# EAGLE design Esquematico (EAGLE 9.6.2)
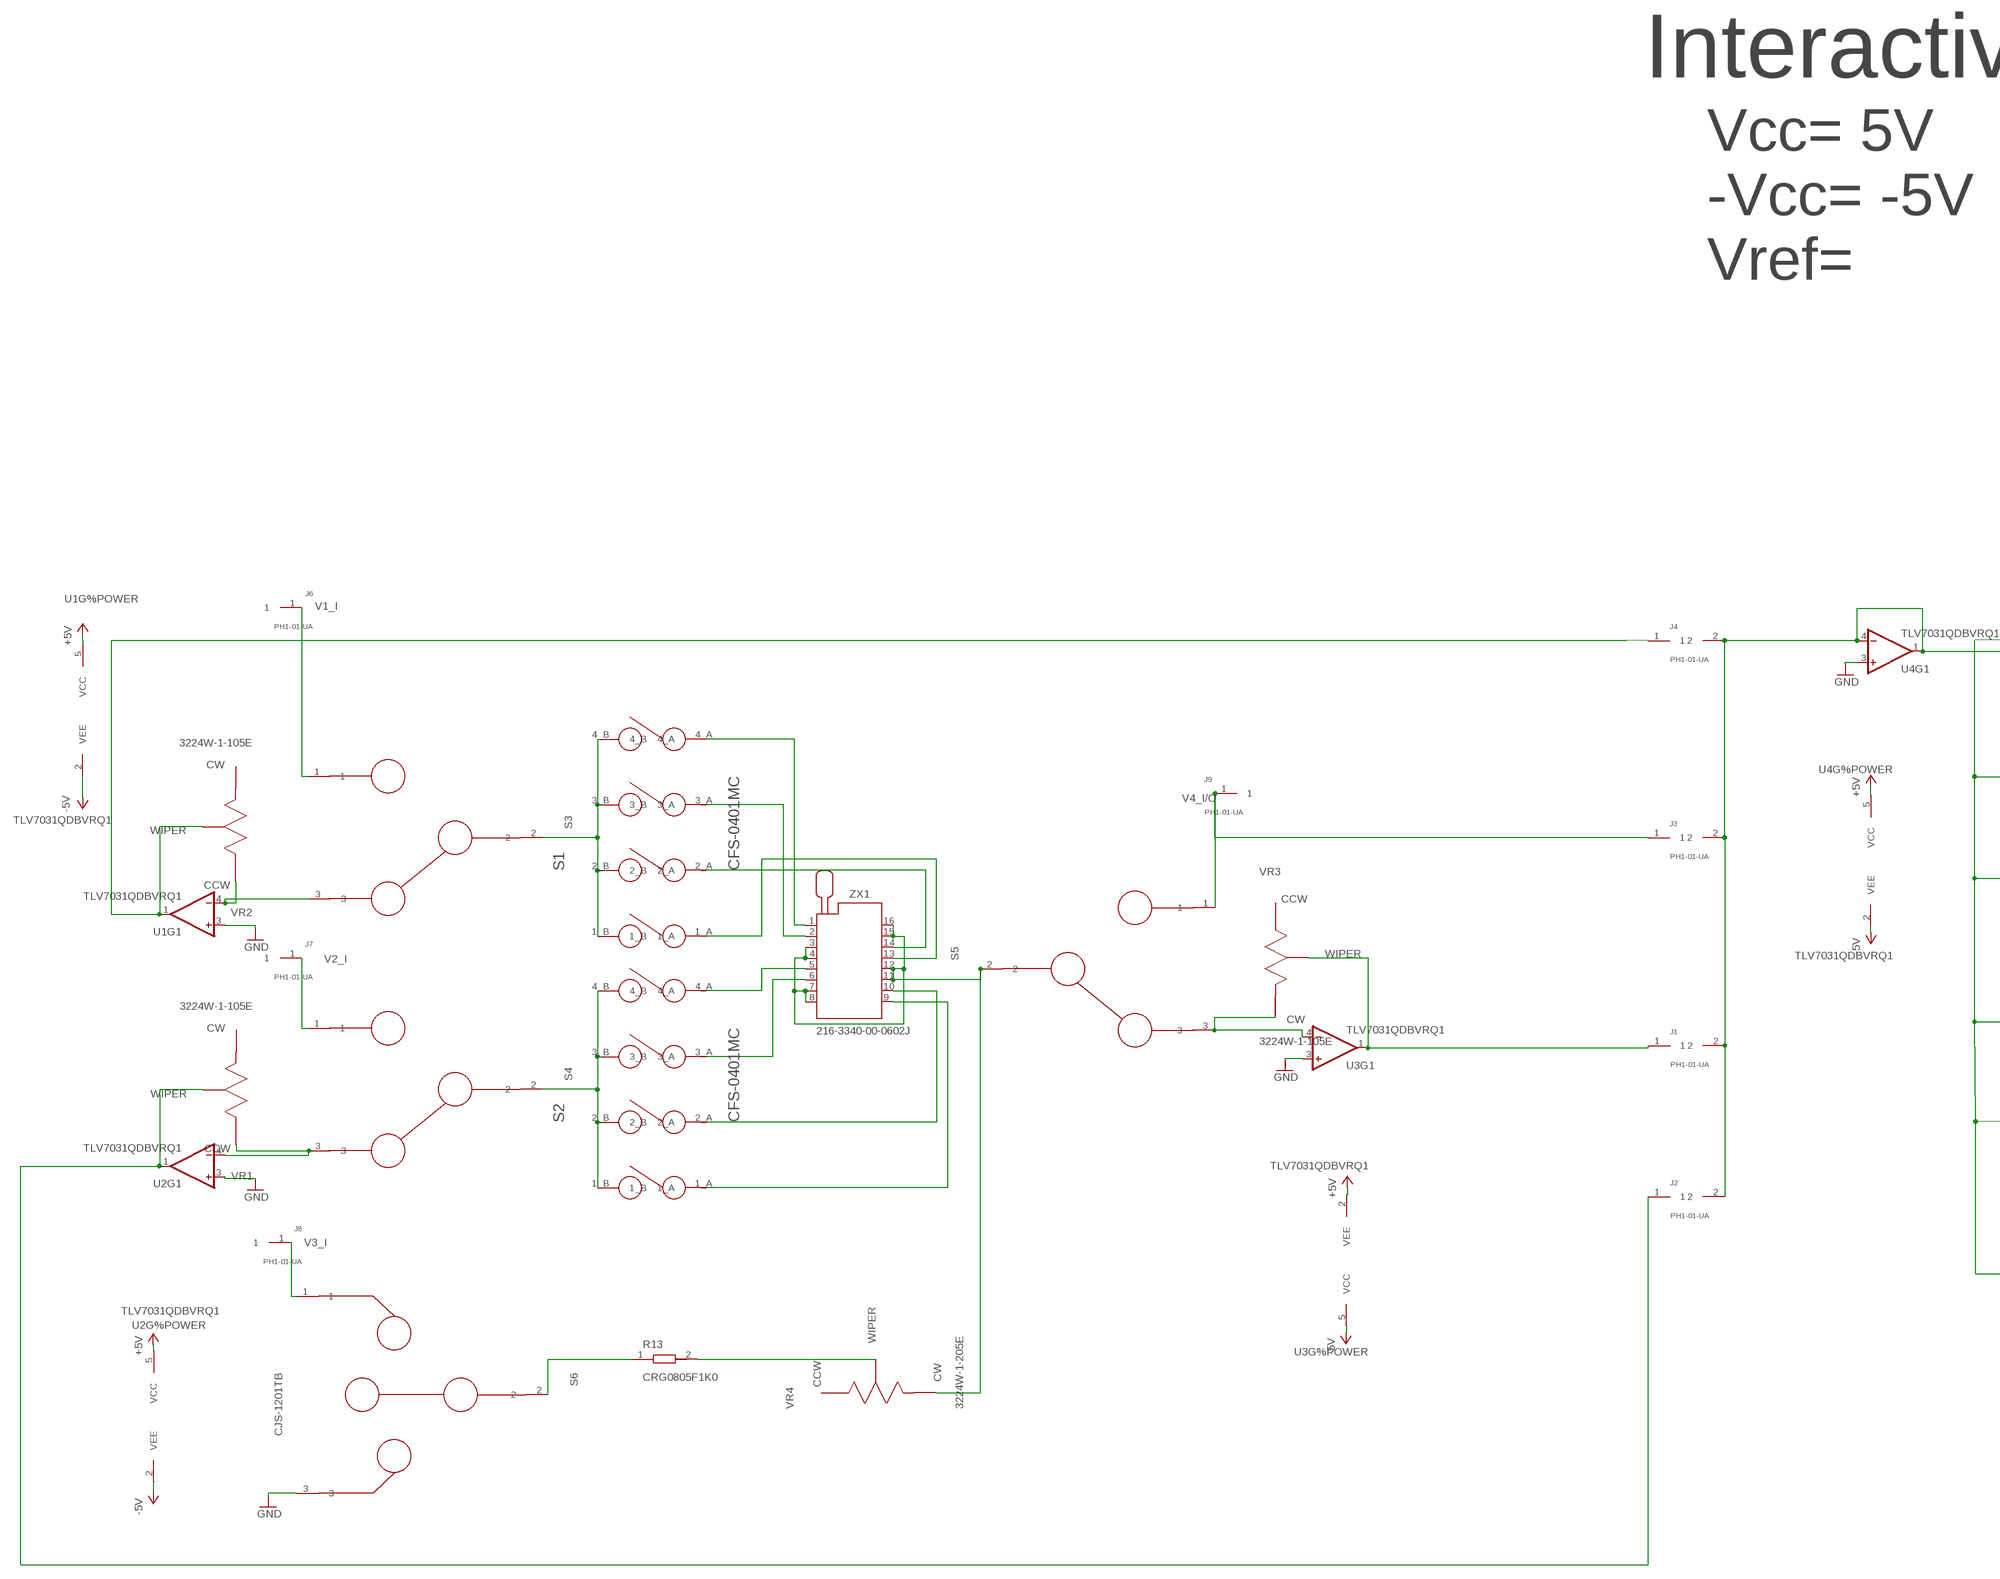
[diagram p0: schematic, sheet 1, part 1 of 2]
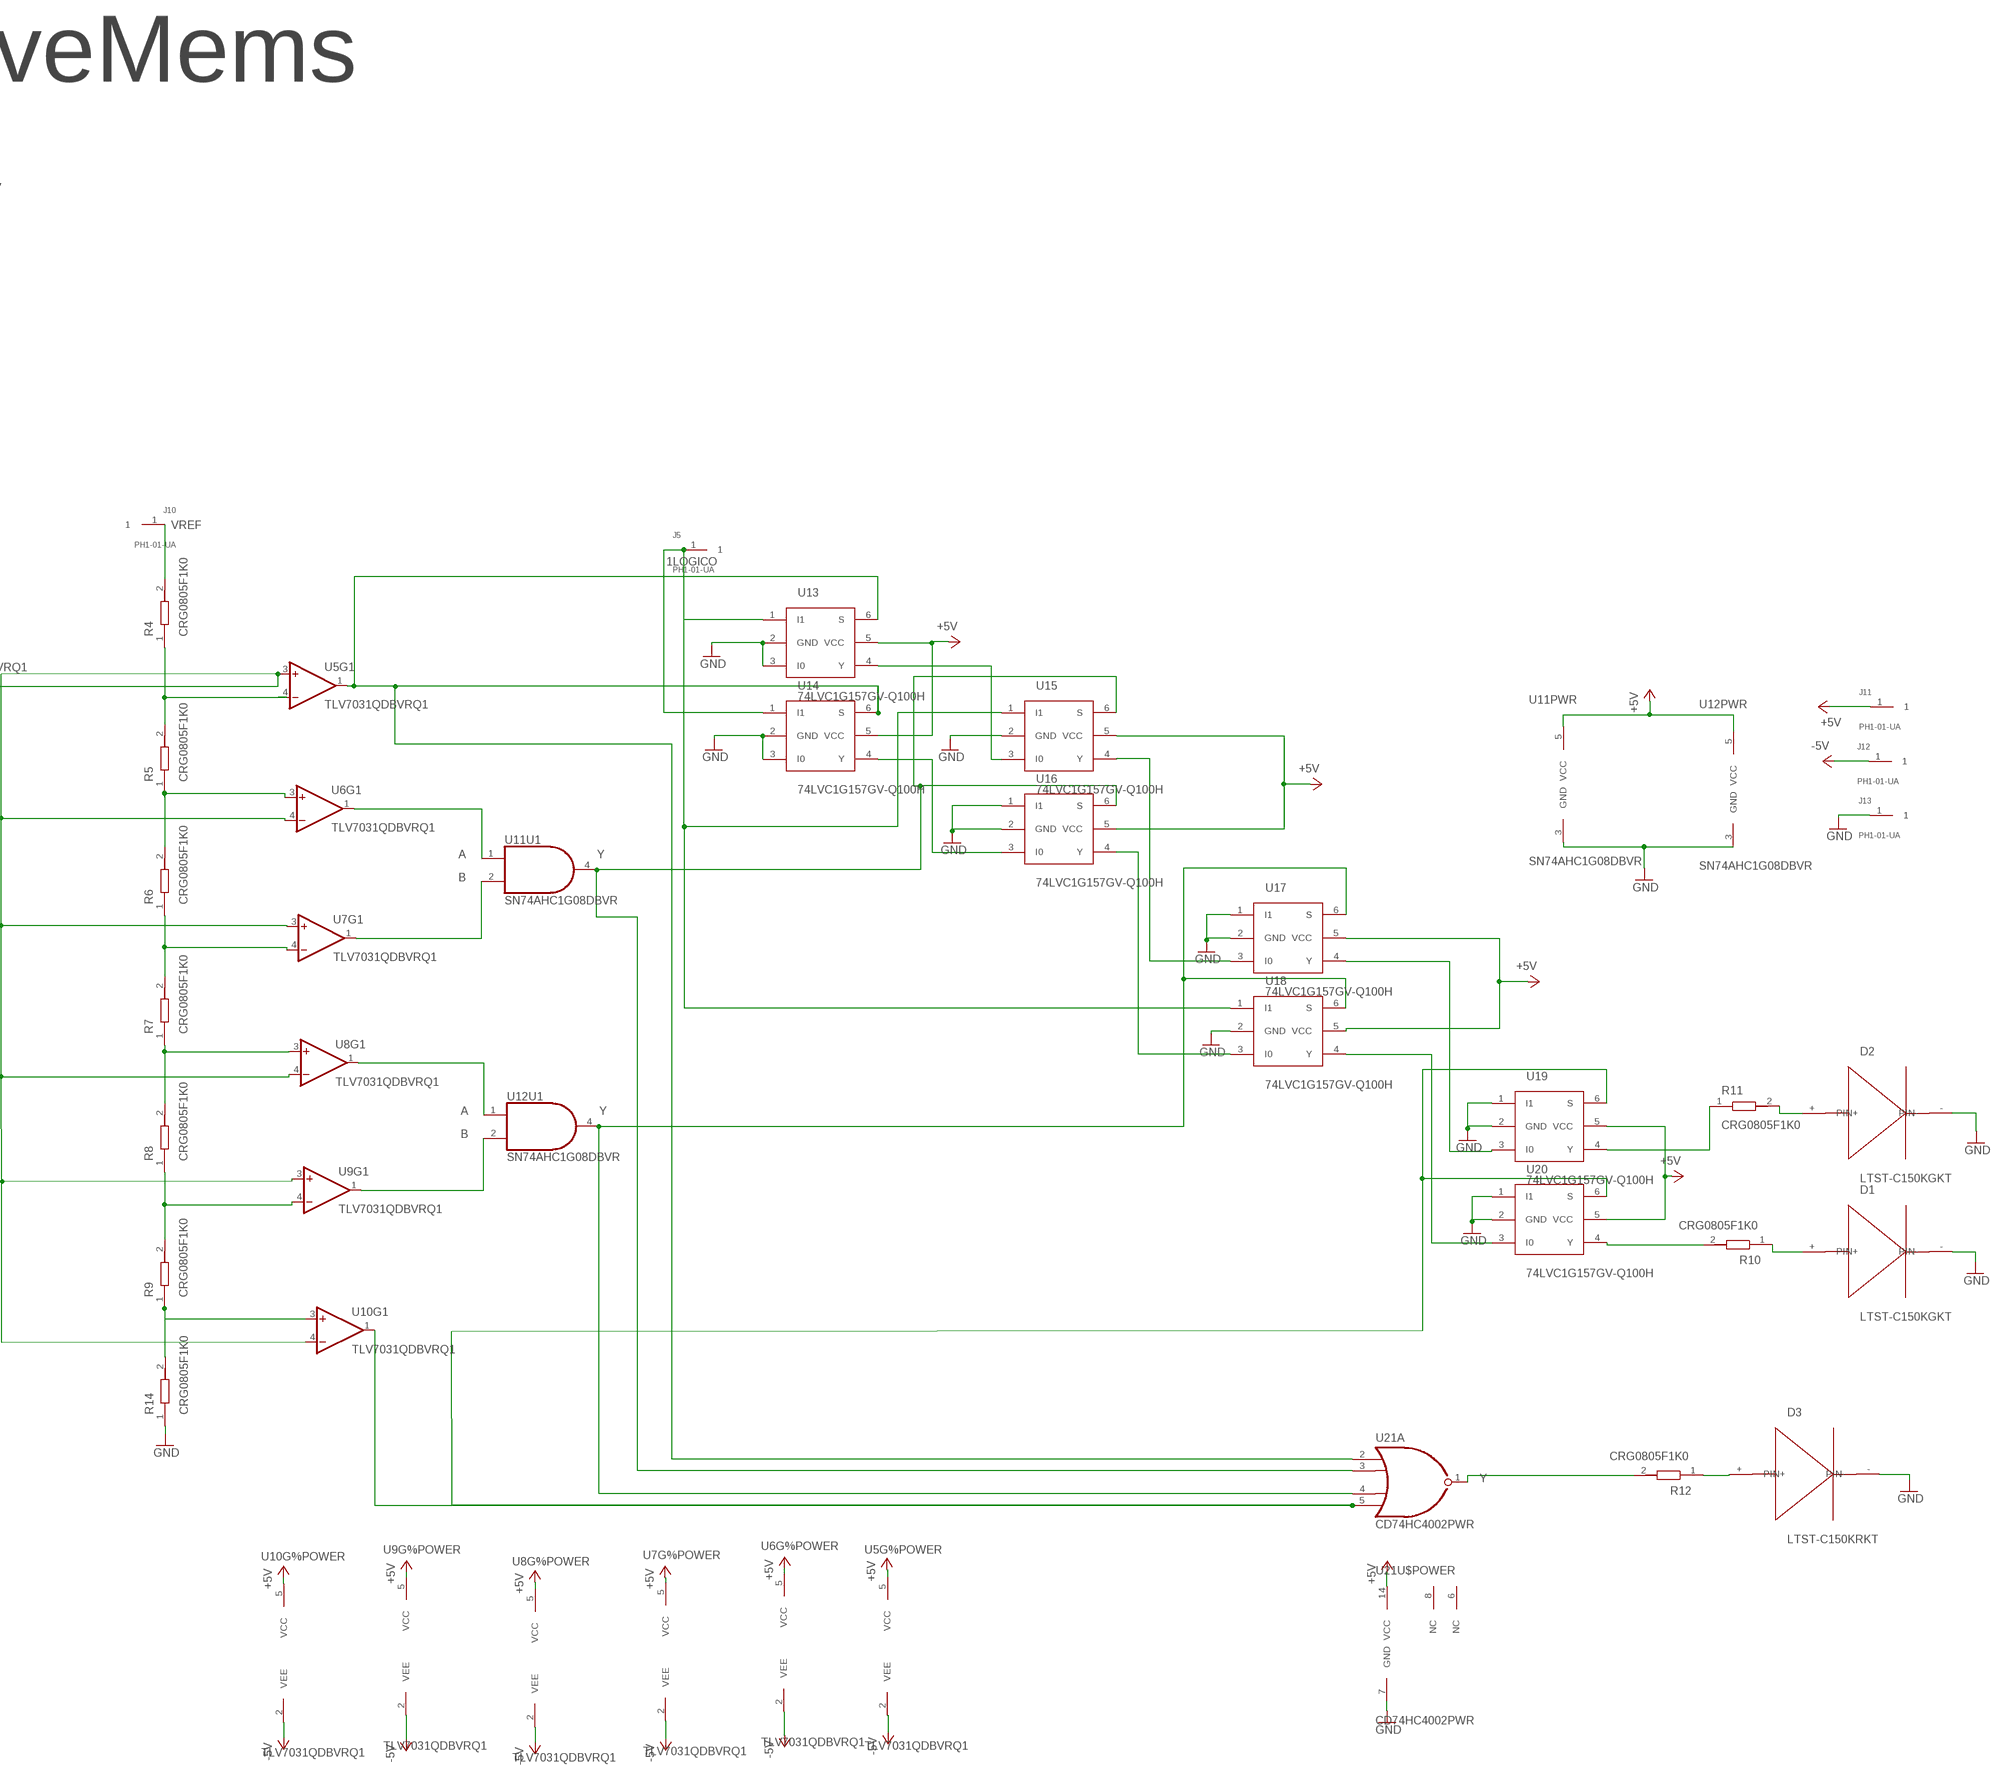
[diagram p1: schematic, sheet 1, part 2 of 2]

## Parts
D1  LTST-C150KGKT  LTST-C150KRKT  [1206]
D2  LTST-C150KGKT  LTST-C150KRKT  [1206]
D3  LTST-C150KRKT  [1206]
J1  PH1-01-UA  (2X)PH1-01-UA  [HEADER]
J2  PH1-01-UA  (2X)PH1-01-UA  [HEADER]
J3  PH1-01-UA  (2X)PH1-01-UA  [HEADER]
J4  PH1-01-UA  (2X)PH1-01-UA  [HEADER]
J5  PH1-01-UA  [HEADER]
J6  PH1-01-UA  [HEADER]
J7  PH1-01-UA  [HEADER]
J8  PH1-01-UA  [HEADER]
J9  PH1-01-UA  [HEADER]
J10  PH1-01-UA  [HEADER]
J11  PH1-01-UA  PH1-01-UA  [HEADER]
J12  PH1-01-UA  PH1-01-UA  [HEADER]
J13  PH1-01-UA  PH1-01-UA  [HEADER]
R4  CRG0805F1K0  CRG0805F1K0  [0805]
R5  CRG0805F1K0  CRG0805F1K0  [0805]
R6  CRG0805F1K0  CRG0805F1K0  [0805]
R7  CRG0805F1K0  CRG0805F1K0  [0805]
R8  CRG0805F1K0  CRG0805F1K0  [0805]
R9  CRG0805F1K0  CRG0805F1K0  [0805]
R10  CRG0805F1K0  CRG0805F1K0  [0805]
R11  CRG0805F1K0  CRG0805F1K0  [0805]
R12  CRG0805F1K0  CRG0805F1K0  [0805]
R13  CRG0805F1K0  [0805]
R14  CRG0805F1K0  CRG0805F1K0  [0805]
S1  CFS-0401MC  [DIP_SPST-4]
S2  CFS-0401MC  [DIP_SPST-4]
S3  CJS-1200TB  CJS-1200B  [SPDT]
S4  CJS-1200TB  CJS-1200B  [SPDT]
S5  CJS-1200TB  CJS-1200B  [SPDT]
S6  CJS-1201TB  [SPDT_ON-OFF-ON]
U1  TLV7031QDBVRQ1  [SOT-23]
U2  TLV7031QDBVRQ1  [SOT-23]
U3  TLV7031QDBVRQ1  [SOT-23]
U4  TLV7031QDBVRQ1  [SOT-23]
U5  TLV7031QDBVRQ1  [SOT-23]
U6  TLV7031QDBVRQ1  [SOT-23]
U7  TLV7031QDBVRQ1  [SOT-23]
U8  TLV7031QDBVRQ1  [SOT-23]
U9  TLV7031QDBVRQ1  [SOT-23]
U10  TLV7031QDBVRQ1  [SOT-23]
U11  SN74AHC1G08DBVR  [SOT-23-5]
U12  SN74AHC1G08DBVR  [SOT-23-5]
U13  74LVC1G157GV-Q100H  [6-TSOP]
U14  74LVC1G157GV-Q100H  [6-TSOP]
U15  74LVC1G157GV-Q100H  [6-TSOP]
U16  74LVC1G157GV-Q100H  [6-TSOP]
U17  74LVC1G157GV-Q100H  [6-TSOP]
U18  74LVC1G157GV-Q100H  [6-TSOP]
U19  74LVC1G157GV-Q100H  [6-TSOP]
U20  74LVC1G157GV-Q100H  [6-TSOP]
U21  CD74HC4002PWR  [14-TSSOP]
VR1  3224W-1-105E  3224W-1-205E  [3224W-1-205E]
VR2  3224W-1-105E  3224W-1-205E  [3224W-1-205E]
VR3  3224W-1-105E  3224W-1-205E  [3224W-1-205E]
VR4  3224W-1-205E  [3224W-1-205E]
ZX1  216-3340-00-0602J  [216-3340-00-0602J]

## Nets
1LOGICO: J5.1 U13.1(I1) U14.1(I1) U15.1(I1) U18.1(I1)
+5V: J11.1 U1.5(G%POWER:VCC) U2.5(G%POWER:VCC) U3.2(G%POWER:VEE) U4.5(G%POWER:VCC) U5.5(G%POWER:VCC) U6.5(G%POWER:VCC) U7.5(G%POWER:VCC) U8.5(G%POWER:VCC) U9.5(G%POWER:VCC) U10.5(G%POWER:VCC) U11.5(PWR:VCC) U12.5(PWR:VCC) U13.5(VCC) U14.5(VCC) U15.5(VCC) U16.5(VCC) U17.5(VCC) U18.5(VCC) U19.5(VCC) U20.5(VCC) U21.14(U$POWER:VCC)
-5V: J12.1 U1.2(G%POWER:VEE) U2.2(G%POWER:VEE) U3.5(G%POWER:VCC) U4.2(G%POWER:VEE) U5.2(G%POWER:VEE) U6.2(G%POWER:VEE) U7.2(G%POWER:VEE) U8.2(G%POWER:VEE) U9.2(G%POWER:VEE) U10.2(G%POWER:VEE)
GND: D1.-(PIN-) D2.-(PIN-) D3.-(PIN-) J13.1 R14.1 S6.3 U1.3(+IN) U2.3(+IN) U3.3(+IN) U4.3(+IN) U11.3(PWR:GND) U12.3(PWR:GND) U13.2(GND) U13.3(I0) U14.2(GND) U14.3(I0) U15.2(GND) U16.1(I1) U16.2(GND) U17.1(I1) U17.2(GND) U18.2(GND) U19.1(I1) U19.2(GND) U20.1(I1) U20.2(GND) U21.7(U$POWER:GND)
N$1: S5.2 VR4.3(CW) ZX1.3 ZX1.4 ZX1.7 ZX1.8 ZX1.11 ZX1.12 ZX1.15 ZX1.16
N$2: S1.4_A ZX1.1
N$3: S1.3_A ZX1.2
N$4: S1.2_A ZX1.14
N$5: S1.1_A ZX1.13
N$6: R6.1 R7.2 U7.4(-IN)
N$7: U9.1(OUT) U12.2(U1:B)
N$8: S2.2_A ZX1.10
N$9: S2.1_A ZX1.9
N$10: S1.1_B S1.2_B S1.3_B S1.4_B S3.2
N$11: S2.1_B S2.2_B S2.3_B S2.4_B S4.2
N$12: S3.3 U1.4(-IN) VR2.1(CCW)
N$13: S4.3 U2.4(-IN) VR1.1(CCW)
N$14: S5.3 U3.4(-IN) VR3.3(CW)
N$15: D2.+(PIN+) R11.2
N$16: D1.+(PIN+) R10.1
N$17: D3.+(PIN+) R12.1
N$18: J1.2 J2.2 J3.2 J4.2 U4.1(OUT) U4.4(-IN) U5.3(+IN) U6.4(-IN) U7.3(+IN) U8.4(-IN) U9.3(+IN) U10.4(-IN)
N$21: R13.1 S6.2
N$23: U8.1(OUT) U12.1(U1:A)
N$26: U7.1(OUT) U11.2(U1:B)
N$27: U6.1(OUT) U11.1(U1:A)
N$28: R13.2 VR4.2(WIPER)
N$29: S2.4_A ZX1.5
N$30: R4.1 R5.2 U5.4(-IN)
N$31: S2.3_A ZX1.6
N$32: R5.1 R6.2 U6.3(+IN)
N$33: R9.1 R14.2 U10.3(+IN)
N$34: R7.1 R8.2 U8.3(+IN)
N$35: R8.1 R9.2 U9.4(-IN)
N$36: U5.1(OUT) U13.6(S) U14.6(S) U21.2(A:A)
N$37: U11.4(U1:Y) U15.6(S) U16.6(S) U21.3(A:B)
N$38: U15.4(Y) U17.3(I0)
N$39: U14.4(Y) U16.3(I0)
N$40: U13.4(Y) U15.3(I0)
N$41: U16.4(Y) U18.3(I0)
N$42: U12.4(U1:Y) U17.6(S) U18.6(S) U21.4(A:C)
N$43: U17.4(Y) U19.3(I0)
N$44: U18.4(Y) U20.3(I0)
N$45: R10.2 U20.4(Y)
N$47: R11.1 U19.4(Y)
N$49: U10.1(OUT) U19.6(S) U20.6(S) U21.5(A:D)
N$50: R12.2 U21.1(A:Y)
V1_I: J6.1 S3.1
V1_O: J4.1 U1.1(OUT) VR2.2(WIPER)
V2_I: J7.1 S4.1
V2_O: J2.1 U2.1(OUT) VR1.2(WIPER)
V3_I: J8.1 S6.1
V3_O: J1.1 U3.1(OUT) VR3.2(WIPER)
V4_I/O: J3.1 J9.1 S5.1
VREF: J10.1 R4.2
Unconnected: U21.6(U$POWER:NC) U21.8(U$POWER:NC) U21.9(B:A) U21.10(B:B) U21.11(B:C) U21.12(B:D) U21.13(B:Y) VR1.3(CW) VR2.3(CW) VR3.1(CCW) VR4.1(CCW)

## Notes on the sheet
- InteractiveMems
- Vcc= 5V
  -Vcc= -5V
  Vref=

## Library data of the parts
D1 D2 = LTST-C150KRKT - Lite-On:LTST-C150KRKT; PARTNO: LTST-C150KGKT
D3 = LTST-C150KRKT - Lite-On:LTST-C150KRKT; PARTNO: LTST-C150KRKT
J1-J4 = (2x)PH1-01-UA - Adam Tech:(2X)PH1-01-UA; PARTNO: PH1-01-UA
J5-J13 = PH1-01-UA - Adam Tech:PH1-01-UA; PARTNO: PH1-01-UA
R4-R14 = CRG0805F1K0 - TE:CRG0805F1K0; PARTNO: CRG0805F1K0
S1 S2 = CFS-0401MC - Nidec Copal Electronics:CFS-0401MC; PARTNO: CFS-0401MC
S3-S5 = CJS-1200TB - Nidec Copal:CJS-1200B; PARTNO: CJS-1200TB
S6 = CJS-1201TB - Nidec Copal Electronics:CJS-1201TB; PARTNO: CJS-1201TB
U1-U10 = TLV7031QDBVRQ1 - Texas Instruments:TLV7031QDBVRQ1; PARTNO: TLV7031QDBVRQ1
U11 U12 = SN74AHC1G08DBVR - TI:SN74AHC1G08DBVR; PARTNO: SN74AHC1G08DBVR
U13-U20 = 74LVC1G157GV-Q100H - Nexperia:74LVC1G157GV-Q100H; PARTNO: 74LVC1G157GV-Q100H
U21 = CD74HC4002PWR:CD74HC4002PWR; PARTNO: CD74HC4002PWR
VR1-VR3 = 3224W-1-205E - Bourns:3224W-1-205E; PARTNO: 3224W-1-105E
VR4 = 3224W-1-205E - Bourns:3224W-1-205E; PARTNO: 3224W-1-205E
ZX1 = 216-3340-00-0602J:216-3340-00-0602J: Zero Insertion Force Socked Source: http://www.3M.com/ehpd Check availability <https://pricing.snapeda.com/parts/216-3340-00-0602J/3M%20Electronic%20Solutions%20Division/view-part?ref=eda>; PARTNO: 216-3340-00-0602J

## Board
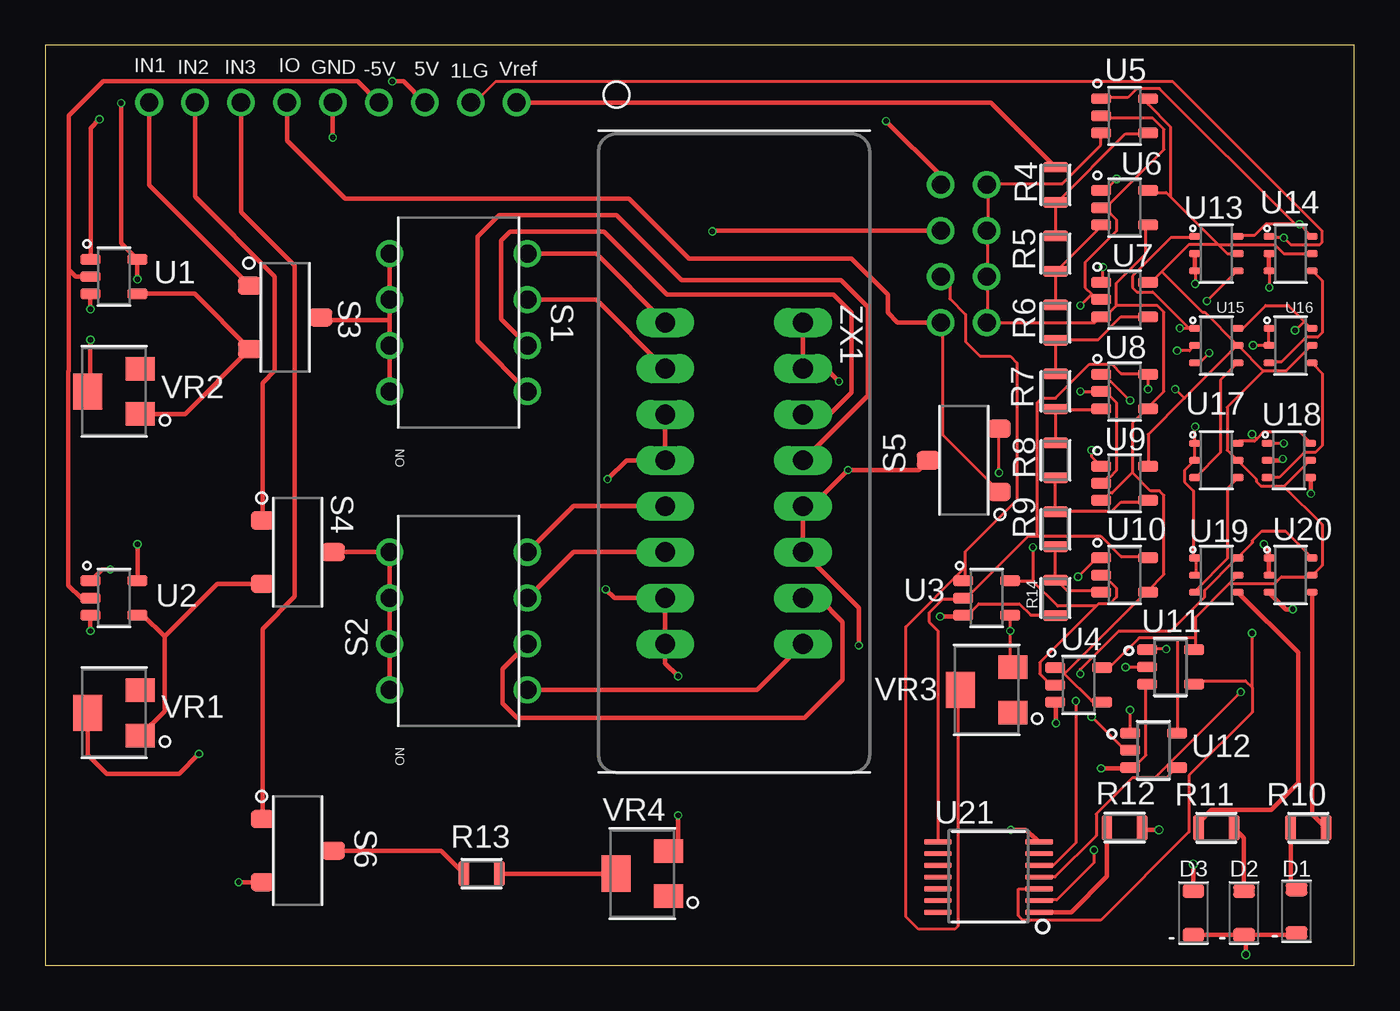
[diagram p2: board, top side]
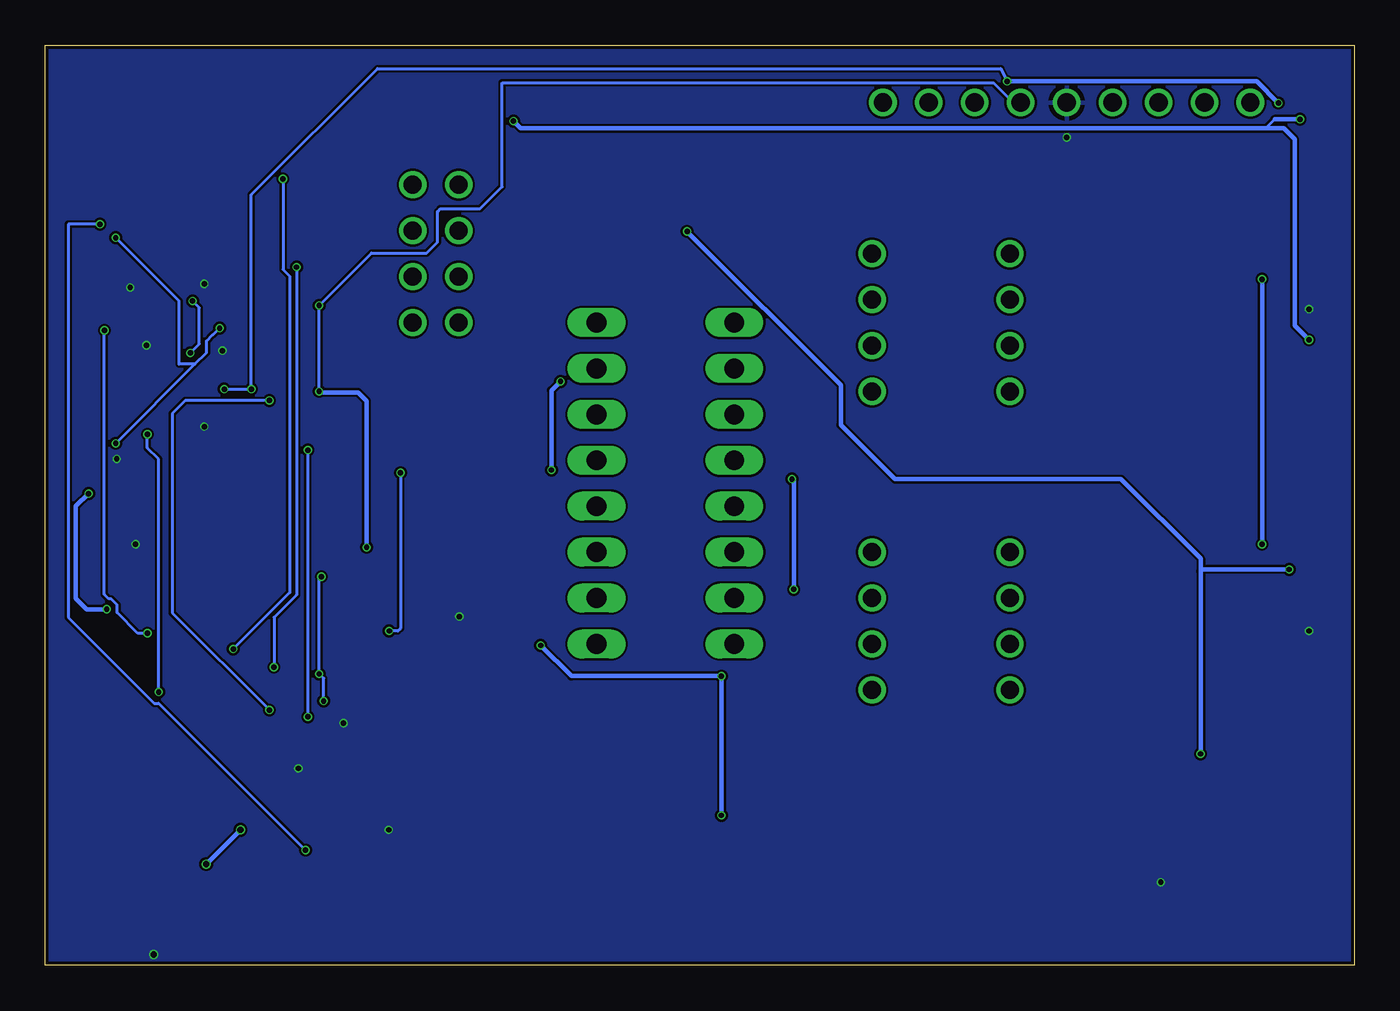
[diagram p3: board, bottom side, seen from below]

Size 72.4 x 50.9 mm. Coordinates in mm from the lower left corner, seen from the top.
Outline: 0,0 72.4,0 72.4,50.9 0,50.9 0,0
Copper layers (1*16): Top 0.035mm / dielectric 1.6mm / Bottom 0.035mm
Design rules "jlcpcb-2layers *": minimum track width 5mil, minimum drill 0.3mm, track to track 5mil, track to pad 5mil, pad to pad 5mil, via to via 5mil, smd to smd 5mil, copper to edge 0.2mm, drill to drill 6mil, minimum pad ring 10mil, minimum via ring 3mil, stop-mask expansion 4mil, vias tented up to drill 15mil, thermal gap 10mil

### Footprints (pad centres in the part's own frame; a part is rotated, then mirrored left to right if it is on the bottom)
1206 = smd 1.2 x 0.77: + 0,1.215; - 0,-1.215
HEADER = drill 1: 1 -1.27,0; 2 1.27,0
HEADER' = drill 1.016: 1 0,0
0805 = smd 0.6 x 1.4: 1 -0.975,0; 2 0.975,0
DIP_SPST-4 = drill 1: 1_A -3.81,-3.81; 1_B -3.81,3.81; 2_A -1.27,-3.81; 2_B -1.27,3.81; 3_A 1.27,-3.81; 3_B 1.27,3.81; 4_A 3.81,-3.81; 4_B 3.81,3.81
SPDT = smd 1 x 1.3: 1 -1.75,-1.95; 2 0,1.95; 3 1.75,-1.95
SPDT_ON-OFF-ON = smd 1 x 1.3: 1 -1.75,-1.95; 2 0,1.95; 3 1.75,-1.95
SOT-23 = smd 1.1 x 0.6: 1 -1.3,0.95; 2 -1.3,0; 3 -1.3,-0.95; 4 1.3,-0.95; 5 1.3,0.95
SOT-23-5 = smd 1.1 x 0.6: 1 -1.3,0.95; 2 -1.3,0; 3 -1.3,-0.95; 4 1.3,-0.95; 5 1.3,0.95
6-TSOP = smd 0.6 x 0.4: 1 -1.2,0.95; 2 -1.2,0; 3 -1.2,-0.95; 4 1.2,-0.95; 5 1.2,0; 6 1.2,0.95
14-TSSOP = smd 1.55 x 0.3: 1 -2.8,1.95; 2 -2.8,1.3; 3 -2.8,0.65; 4 -2.8,0; 5 -2.8,-0.65; 6 -2.8,-1.3; 7 -2.8,-1.95; 8 2.8,1.95; 9 2.8,1.3; 10 2.8,0.65; 11 2.8,0; 12 2.8,-0.65; 13 2.8,-1.3; 14 2.8,-1.95
3224W-1-205E = smd 1.6 x 1.3: 1 1.45,-1.25; 3 1.45,1.25 | smd 1.6 x 2: 2 -1.45,0
216-3340-00-0602J = drill 1.1 long: 1 -8.89,-3.81; 2 -6.35,-3.81; 3 -3.81,-3.81; 4 -1.27,-3.81; 5 1.27,-3.81; 6 3.81,-3.81; 7 6.35,-3.81; 8 8.89,-3.81; 9 8.89,3.81; 10 6.35,3.81; 11 3.81,3.81; 12 1.27,3.81; 13 -1.27,3.81; 14 -3.81,3.81; 15 -6.35,3.81; 16 -8.89,3.81

### Placement (x,y rotation side)
D1  69.2,3 0 top
D2  66.3,2.9 0 top
D3  63.5,2.9 0 top
J1  50.8,38.1 0 top
J2  50.8,40.64 0 top
J3  50.8,35.56 0 top
J4  50.8,43.18 0 top
J5  PH1-01-UA  [HEADER']  23.53,47.73 0 top
J6  PH1-01-UA  [HEADER']  5.75,47.73 180 top
J7  PH1-01-UA  [HEADER']  8.29,47.73 0 top
J8  PH1-01-UA  [HEADER']  10.83,47.73 0 top
J9  PH1-01-UA  [HEADER']  13.37,47.73 0 top
J10  PH1-01-UA  [HEADER']  26.07,47.73 0 top
J11  PH1-01-UA  [HEADER']  20.99,47.73 0 top
J12  PH1-01-UA  [HEADER']  18.45,47.73 0 top
J13  PH1-01-UA  [HEADER']  15.91,47.73 0 top
R4  55.88,43.18 90 top
R5  55.88,39.37 90 top
R6  55.88,35.56 90 top
R7  55.88,31.75 90 top
R8  55.88,27.94 90 top
R9  55.88,24.13 90 top
R10  69.85,7.62 0 top
R11  64.77,7.62 0 top
R12  59.69,7.62 180 top
R13  24.13,5.08 0 top
R14  55.88,20.32 90 top
S1  22.86,35.56 90 top
S2  22.86,19.05 90 top
S3  13.27,35.84 270 top
S4  13.97,22.86 270 top
S5  50.8,27.94 90 top
S6  13.97,6.35 270 top
U1  3.81,38.1 0 top
U2  3.81,20.32 0 top
U3  52.07,20.32 0 top
U4  57.15,15.51 0 top
U5  59.69,46.99 0 top
U6  59.69,41.91 0 top
U7  59.69,36.83 0 top
U8  59.69,31.75 0 top
U9  59.69,26.67 0 top
U10  59.69,21.59 0 top
U11  62.23,16.51 0 top
U12  61.29,11.9 0 top
U13  64.77,39.37 0 top
U14  68.88,39.37 0 top
U15  64.77,34.29 0 top
U16  68.88,34.29 0 top
U17  64.77,27.94 0 top
U18  68.78,27.94 0 top
U19  64.77,21.59 0 top
U20  68.88,21.59 0 top
U21  52.17,4.89 180 top
VR1  3.81,13.97 0 top
VR2  3.81,31.75 0 top
VR3  52.07,15.24 0 top
VR4  33.02,5.08 0 top
ZX1  38.1,26.67 270 top

### Tracks (layer width: path | path; a pad name or v marks a point on that pad's centre or on a via)
1LOGICO  (via drill 0.3)
  Top 0.152: 63.25,35.25 63.5,35.25 U15.1 | 63.25,35.25 61.25,37.25 60.38,37.25 60.12,37.5 60.12,38.12 62.25,40.25 63.5,40.25 U13.1 | v68.5,28.88 67.62,28.88 U18.1 | U14.1 67.75,40.25 v68.5,40.25 68.88,39.88 70.5,39.88 70.62,40 70.62,40.62 62.38,48.88 24.9,48.88 23.77,47.75 23.62,47.75 J5.1 | v62.75,35.25 63.25,35.25
  Bottom 0.152: 64.12,33.25 v68.5,28.88 | v68.5,40.25 65,36.75 65,33.25 64.12,33.25 | v62.75,35.25 63.12,34.88 63.14,34.88 63.48,34.54 63.48,33.89 64.12,33.25
+5V  (via drill 0.3)
  Top 0.152: U21.14 49.38,6.88 49.38,18.5 48.88,19 48.88,19.5 49.62,20.25 50.75,20.25 U3.2 50.88,20.25 54.38,23.75 54.88,23.75 | 54.88,23.75 58.38,23.75 59.5,22.62 60.88,22.62 U10.5 | 54.88,23.75 54.88,31.12 55.12,31.38 55.88,31.38 57.75,33.25 59,33.25 59.5,32.75 60.88,32.75 U8.5 61,32.62 v61,31.88 | 65.5,21.12 63.62,19.25 63.62,18.12 | 65.5,21.12 65.88,21.5 U19.5 | 63.62,18.12 63.62,17.5 U11.5 | 65.5,21.12 68,21.12 68.38,21.5 70,21.5 U20.5 70.12,21.62 70.62,22.12 70.62,24.38 68.5,26.5 | 63.62,18.12 62.62,18.12 | 62.62,18.12 60.5,18.12 58.88,16.5 58.5,16.5 U4.5 | 62.62,18.12 62.62,12.88 U12.5 | 68.5,26.5 67.25,26.5 67,26.75 67,26.88 66,27.88 U17.5 65.88,28 65.38,28.5 65.38,30.88 67.38,32.88 | 68.5,26.5 69.88,27.88 U18.5 | 67.38,32.88 66,34.25 U15.5 | 67.38,32.88 68.62,32.88 70,34.25 U16.5 | 63,31.38 65.88,34.25 U15.5 | 63,31.38 61,29.38 U9.5 | 62.25,42.5 62,42.75 61,42.75 U6.5 | 62.25,42.5 64.88,39.88 | 64.88,39.88 65.38,39.38 65.88,39.38 U13.5 | 64.88,39.88 68,39.88 68.5,39.38 70,39.38 U14.5 | 61.75,38.38 63.25,39.88 64.88,39.88 | 61.75,38.38 61.25,37.88 61,37.88 U7.5 | 62.25,42.5 62.25,46.38 61,47.62 61,47.88 U5.5 | 61.75,38.38 64,36.12 64.12,36.12 65.88,34.38 U15.5 | 63,31.38 v62.5,31.88
  Top 0.254: v4.2,47.7 4.2,39.96 U1.5 v5.1,37.96 | v19.2,48.9 19.82,48.9 J11.1 | U2.5 v5.11,23.29 v5.1,23.3
  Bottom 0.152: v62.5,31.88 v61,31.88 61,42.62 54.02,49.6 19.55,49.6 v19.2,48.9
  Bottom 0.254: v4.2,47.7 5.4,48.9 v19.2,48.9 | v5.1,23.3 v5.1,37.96
-5V  (via drill 0.3)
  Top 0.152: 58.12,19.88 58.25,20 58.88,20 59.25,20.38 59.25,20.88 58.5,21.62 U10.2 | 58.12,19.88 55,16.75 55,16.12 55.5,15.62 55.75,15.62 U4.2 | 54.62,21.25 53.38,21.25 U3.5 | 54.62,21.25 56,19.88 58.12,19.88 | U9.2 58.5,26.75 58.75,27 58.88,27 59.25,27.38 59.25,31.12 58.62,31.75 U8.2 v57.25,31.75 | 57.88,37.12 57.5,37.5 57.5,38.88 59.25,40.62 59.25,41.25 58.62,41.88 | 57.88,37.12 58.12,36.88 58.38,36.88 U7.2 | 58.62,41.88 58.5,42 U6.2 58.62,41.88 | 58.62,41.88 61.88,45.12 61.88,46.25 61.25,46.88 58.5,46.88 U5.2 | 57.88,37.12 v57.25,36.5 | v54.62,23.12 54.62,21.25
  Top 0.254: U1.2 1.7,38.1 1.3,38.5 | 1.3,38.5 1.3,47 3.2,48.9 17.28,48.9 J12.1 | U2.2 1.98,20.32 1.28,21.02 1.28,32.87 1.3,32.88 1.3,38.5
  Bottom 0.152: J12.1 18.5,47.75 18.88,47.75 19.95,48.83 47.12,48.83 47.12,43.08 48.35,41.85 50.55,41.85 50.7,41.7 50.7,40 51.3,39.4 54.35,39.4 v57.25,36.5 v57.25,31.75
  Bottom 0.254: v54.62,23.12 54.62,31.23 55.1,31.7 57.2,31.7 v57.25,31.75
GND  (via drill 0.3, 0.35)
  Top 0.152: U19.2 63.62,21.62 63.62,22.5 U19.1 63.5,22.62 63.5,26.25 63,26.75 63,27.38 63.5,27.88 U17.2 U17.1 63.57,29.77 v63.6,29.8 | U11.3 60.88,15.5 60.88,11.62 60.25,11 60,11 U12.3 | R14.1 55.88,19.38 54.5,19.38 53.88,20 51.62,20 50.88,19.25 U3.3 | 63.6,38.39 v63.6,37.7 | 67.7,38.4 v67.7,37.5 | U15.2 63.28,34 v62.6,34 | 67.68,35.38 U16.1 U16.2 v66.81,34.29 v66.8,34.3
  Top 0.254: U1.3 v2.5,36.3 | U2.3 v2.5,18.5 | S6.3 v10.7,4.6 | U12.3 59.94,10.9 v58.4,10.9 | U20.2 U20.1 67.68,23.02 v67.4,23.3 | U14.2 U14.3 67.7,38.4 | U13.2 U13.3 63.6,38.39 | U4.3 55.9,14.51 v55.9,13.4 | U3.3 50.7,19.3 v49.5,19.3 | U21.7 54.21,7.5 v53.4,7.5 | J13.1 v15.91,45.81 v15.9,45.8 | 67.52,27.88 U18.2 68.37,27.94 v68.44,28.02 | D3.- D2.- | D2.- 69.1,1.69 D1.- | D2.- 66.4,1.58 v66.4,0.6
  pour Bottom: 0,0 72.4,0 72.4,50.9 0,50.9
N$1  (via drill 0.3)
  Top 0.254: ZX1.3 ZX1.4 32.14,27.94 v31.1,26.9 | v31,20.8 31.48,20.32 ZX1.7 ZX1.8 34.29,16.71 v35,16 | ZX1.16 ZX1.15 43.18,33.02 v43.9,32.3 | v45,17.7 45,19.77 ZX1.11 ZX1.12 42.4,25.4 v44.4,27.4 48.31,27.4 S5.2 | v35,8.3 35,6.86 VR4.3
  Bottom 0.254: v31,20.8 31,26.8 v31.1,26.9 | v45,17.7 43.3,16 v35,16 v35,8.3 | v43.9,32.3 44.4,31.8 v44.4,27.4
N$2
  Top 0.254: ZX1.1 30.48,39.37 S1.4_A
N$3
  Top 0.254: ZX1.2 30.48,36.83 S1.3_A
N$4
  Top 0.254: S1.2_A 25.2,35.76 25.2,40.1 25.7,40.6 30.9,40.6 34.4,37.1 43.6,37.1 44.6,36.1 44.6,31.7 43.38,30.48 ZX1.14
N$5
  Top 0.254: S1.1_A 23.9,34.52 23.9,40.3 25.1,41.5 31.6,41.5 35.2,37.9 44,37.9 45.5,36.4 45.5,31.53 ZX1.13
N$6
  Top 0.152: U7.4 60.88,35.88 59.5,35.88 58.25,34.62 56,34.62 R6.1 55.88,34.5 55.88,32.75 R7.2
N$7  (via drill 0.3)
  Top 0.152: v57.88,13.75 59.62,12 59.88,12 U12.2 | v57.88,28.5 57.88,28.12 58.38,27.62 U9.1
  Bottom 0.152: v57.88,28.5 v57.88,13.75
N$8
  Top 0.254: S2.2_A 25.3,16.41 25.3,14.5 26.1,13.7 42,13.7 44.1,15.8 44.1,19 42.78,20.32 ZX1.10
N$9
  Top 0.254: S2.1_A 39.37,15.24 ZX1.9
N$10
  Top 0.254: S1.4_B S1.3_B 19.05,35.7 | 19.05,35.7 S1.2_B S1.1_B | 19.05,35.7 15.36,35.7 S3.2
N$11
  Top 0.254: S2.1_B S2.2_B S2.3_B S2.4_B S4.2
N$12
  Top 0.254: VR2.1 7.73,30.5 S3.3 8.26,37.15 U1.4
N$13
  Top 0.254: VR1.1 6.6,14.06 6.6,18.2 | 6.6,18.2 5.43,19.37 U2.4 | 6.6,18.2 9.51,21.11 S4.3
N$14  (via drill 0.3)
  Top 0.152: U3.4 53.38,19.25 v53.38,18.5 53.38,16.62 53.5,16.5 VR3.3 | v52.75,27.25 S5.3
  Bottom 0.152: v52.75,27.25 52.75,18.65 52.9,18.5 v53.38,18.5
N$15
  Top 0.254: D2.+ 66.3,7.07 R11.2
N$16
  Top 0.254: D1.+ 68.88,4.54 R10.1
N$17  (via drill 0.35)
  Top 0.254: D3.+ v63.5,5.6 | v61.6,7.5 60.78,7.5 R12.1
  Bottom 0.254: v63.5,5.6 v61.6,7.5
N$18
  Top 0.152: U5.3 58.38,46 58.38,45.38 56.25,43.25 52.12,43.25 J4.2 52.12,43.12 52.12,40.75 J2.2 52.12,40.62 52.12,38.12 J1.2 52.12,38 52.12,35.62 J3.2 58.06,35.56 58.38,35.88 U7.3 58.5,36 58.75,36 59.25,36.5 | 59.25,36.5 59.25,37.75 60.88,39.38 60.88,40.88 U6.4 | 60.12,27.25 59,26.12 58.88,26.12 58.5,25.75 U9.3 | 60.12,27.25 60.12,30 60.88,30.75 U8.4 61,30.88 61.88,31.75 61.88,36.12 61.5,36.5 59.25,36.5 | 56.38,16.12 56.12,16.38 55.88,16.38 U4.1 | 56.38,16.12 57.88,14.62 58.38,14.62 U4.4 | 56.38,16.12 60.88,20.62 U10.4 61,20.75 61.88,21.62 61.88,26 61.62,26.25 61.12,26.25 60.12,27.25
N$21
  Top 0.254: R13.1 21.89,6.35 S6.2
N$23  (via drill 0.3)
  Top 0.152: v60,14.12 60,12.88 U12.1 | v60,31.25 58.5,32.75 U8.1
  Bottom 0.152: v60,14.12 65.38,19.5 65.38,30.52 64.65,31.25 v60,31.25
N$26  (via drill 0.3)
  Top 0.152: v59.75,16.5 60.88,16.5 U11.2 | v58.5,38.62 58.5,37.88 U7.1
  Bottom 0.152: v59.75,16.5 59.75,19.25 58.5,20.5 v58.5,38.62
N$27  (via drill 0.3)
  Top 0.152: v62,17.5 61,17.5 U11.1 | v59.25,43.5 58.5,42.75 U6.1
  Bottom 0.152: v62,17.5 58.88,20.62 58.88,38.12 59.25,38.5 v59.25,43.5
N$28
  Top 0.254: VR4.2 R13.2
N$29
  Top 0.254: S2.4_A 29.21,25.4 ZX1.5
N$30
  Top 0.152: U5.4 60.88,46 59.75,46 56,42.25 R4.1 55.88,42.12 55.88,40.38 R5.2
N$31
  Top 0.254: S2.3_A 29.21,22.86 ZX1.6
N$32
  Top 0.152: U6.3 58.38,40.88 56,38.5 R5.1 55.88,38.38 55.88,36.62 R6.2
N$33
  Top 0.152: U10.3 58.38,20.75 56.5,20.75 56,21.25 R14.2 55.88,21.38 55.88,23.12 R9.1
N$34
  Top 0.152: U8.3 58.38,30.75 56,30.75 R7.1 55.88,30.75 55.88,29 R8.2
N$35
  Top 0.152: U9.4 60.88,25.62 59.5,25.62 59,25.12 56,25.12 R9.2 55.88,25.12 55.88,26.88 R8.1
N$36  (via drill 0.3)
  Top 0.152: 69.12,41 67.5,41 66.88,40.38 66,40.38 U13.6 | U14.6 70,40.38 v69.38,41 69.12,41 | v58,6.38 58,5.67 55.95,3.62 54.88,3.62 U21.2 | 69.12,41 61.62,48.5 60.38,48.5 59.88,48 58.5,48 U5.1
  Bottom 0.152: v58,6.38 66.12,14.5 66.38,14.5 71.12,19.25 71.12,41 v69.38,41
N$37  (via drill 0.3)
  Top 0.152: 69.62,35.62 70,35.25 U16.6 | 69.62,35.62 68.75,36.5 67.5,36.5 66.25,35.25 66,35.25 U15.6 | 66.75,15.38 66.75,14 63.25,10.5 63.25,7.38 58.38,2.5 54.08,2.5 53.83,2.75 53.83,4.22 54.94,4.22 U21.3 | 66.75,15.38 66.38,15.75 63.75,15.75 63.62,15.62 U11.4 | v69.12,35.12 69.62,35.62 | 66.75,15.38 v66.75,18.38
  Bottom 0.152: v66.75,18.38 67.28,18.38 68.42,19.52 68.42,19.94 68.76,20.28 68.88,20.28 69.12,20.52 v69.12,35.12
N$38
  Top 0.152: U17.3 63.62,27 65,28.38 65,32.38 65.88,33.25 U15.4
N$39
  Top 0.152: U14.4 70.62,37.88 70.62,35 70.38,34.75 69.75,34.75 68.38,33.38 67.75,33.38 U16.3
N$40  (via drill 0.3)
  Top 0.152: v64.38,33.88 63.88,33.38 63.62,33.38 U15.3 | v64.25,36.75 65.88,38.38 U13.4
  Bottom 0.152: v64.38,33.88 63.88,34.38 63.88,36.38 v64.25,36.75
N$41
  Top 0.152: U18.3 67.62,27 68.25,27 69.62,28.38 70.25,28.38 70.62,28.75 70.62,32.75 70.12,33.25 U16.4
N$42  (via drill 0.3)
  Top 0.152: 67,29.12 67.38,29.5 69.38,29.5 69.88,29 U18.6 | 67,29.12 66.88,29 66,29 U17.6 | 61.38,10.38 62,10.38 62.5,10.88 U12.4 | 61.38,10.38 60.12,10.38 58.12,8.38 58.12,7.17 55.85,4.9 U21.4 | v66.75,29.38 67,29.12 | 61.38,10.38 v66.12,15.12
  Bottom 0.152: v66.75,29.38 66.75,28.62 66.12,28 v66.12,15.12
N$43
  Top 0.152: U19.3 63.62,20.75 65.38,22.5 65.38,26.38 65.88,26.88 U17.4
N$44  (via drill 0.3)
  Top 0.254: U20.3 68.62,19.7 v69,19.7 | v70,26.1 69.98,26.12 U18.4
  Bottom 0.254: v69,19.7 70.1,19.7 70.7,20.3 70.7,25.4 v70,26.1
N$45
  Top 0.254: R10.2 70.08,8.37 U20.4
N$47
  Top 0.254: U19.4 69.3,17.31 69.3,10.1 67.8,8.6 64.5,8.6 63.8,7.89 R11.1
N$49  (via drill 0.3)
  Top 0.152: U20.6 70,22.62 68.62,24 67.25,24 66.75,23.5 66.75,23.38 66,22.62 U19.6 65.88,22.5 64.12,20.75 64.12,20.38 62.25,18.5 59.38,18.5 57.25,16.38 v57.25,16.12 | U21.5 54.98,5.53 55.75,5.53 57,6.78 v57,14.62 | v57.12,21.5 58.12,22.5 58.38,22.5 U10.1
  Bottom 0.152: v57,14.62 57,15.88 v57.25,16.12 57.25,21.38 v57.12,21.5
N$50
  Top 0.254: U21.1 56.74,2.94 58.72,4.92 R12.2
V1_I
  Top 0.254: S3.1 5.75,43.16 J6.1
V1_O  (via drill 0.3)
  Top 0.254: U1.1 2.51,46.31 v3,46.8 | v46.5,46.7 49.53,43.67 J4.1 | VR2.2 2.5,31.89 v2.5,34.6
  Bottom 0.152: 4.4,46.8 4.9,46.3
  Bottom 0.254: v3,46.8 4.4,46.8 | v46.5,46.7 46.1,46.3 4.9,46.3 3.9,46.3 3.3,45.7 3.3,35.4 v2.5,34.6
V2_I
  Top 0.254: S4.1 12.02,32.22 12.7,32.9 12.7,38.1 8.29,42.51 J7.1
V2_O  (via drill 0.3)
  Top 0.254: J2.1 36.94,40.64 v36.9,40.6 | v8.5,11.7 7.4,10.6 3.4,10.6 2.36,11.64 VR1.2 | U2.1 3.14,21.9 v3.6,21.9
  Bottom 0.254: v36.9,40.6 28.4,32.1 28.4,29.9 25.4,26.9 12.9,26.9 8.5,22.5 8.5,21.8 | 8.5,21.8 v8.5,11.7 | v3.6,21.9 8.4,21.9 8.5,21.8
V3_I
  Top 0.254: S6.1 12.02,18.62 13.8,20.4 13.8,38.7 10.83,41.67 J8.1
V3_O
  Top 0.152: 50.88,22 50.88,22.88 53.75,25.75 53.75,33.33 53.38,33.7 51.7,33.7 50.9,34.5 50.9,36 50.02,36.88 50.02,37.58 J1.1 | 50.88,22 50.88,21.38 U3.1 | 50.88,22 47.6,18.73 47.6,2.7 48.3,2 50.3,2 50.5,2.2 50.5,15.12 VR3.2
V4_I/O
  Top 0.152: S5.1 52.75,26.25 49.62,29.38 49.62,35.5 J3.1
  Top 0.254: J9.1 13.37,45.63 16.6,42.4 32.3,42.4 35.6,39.1 44.6,39.1 46.6,37.1 46.6,36.1 47.14,35.56 J3.1
VREF
  Top 0.254: R4.2 52.3,47.73 J10.1

### Text on the board
tPlace: IN1 | IN2 | IN3 | IO | GND | -5V | 5V | 1LG | Vref